# EAGLE design USB Client SP (EAGLE 5.04)
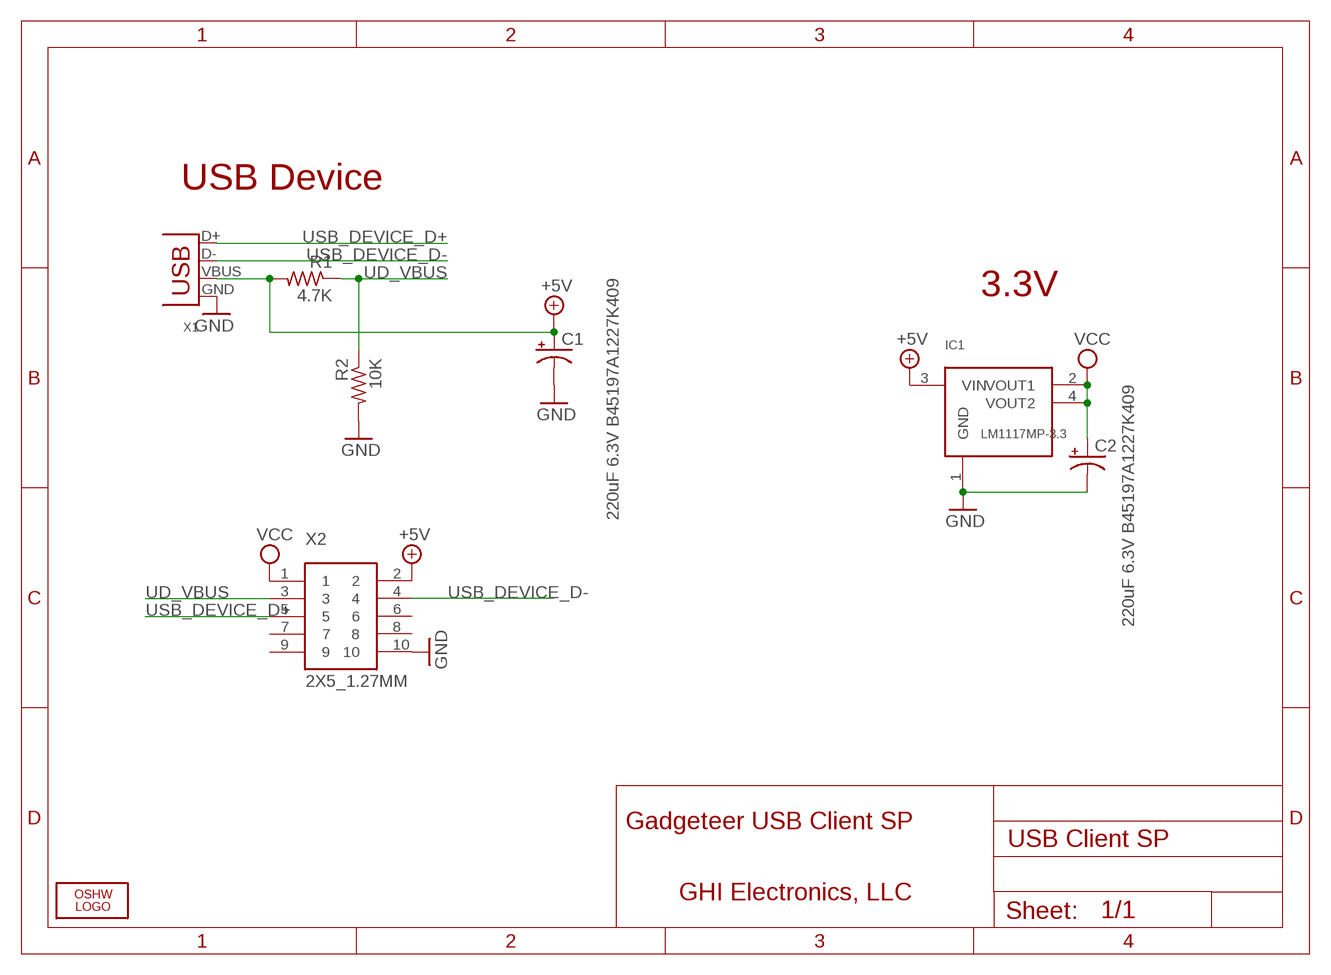
[diagram p0: schematic, sheet 1]

## Parts
C1  220uF 6.3V B45197A1227K409  CPOL-USD/7343-31W  [D/7343-31W]
C2  220uF 6.3V B45197A1227K409  CPOL-USD/7343-31W  [D/7343-31W]
IC1  LM1117MP-3.3  LM1117  [SOT223]
LOGO2  LOGO-OSHW-FILLX0200-NT  [OSHW_FILLX200_NOTEXT]
R1  4.7K  R-US_R0603  [R0603]
R2  10K  R-US_R0603  [R0603]
X1  DX2R005HN2E700  USB-MB-S  [USB-MB-S]
X2  2X5_1.27MM  [2X5_1.27MM]

## Nets
+5V [power]: C1.+ IC1.3(VIN) R1.2 X1.VBUS X2.2
GND [power]: C1.- C2.- IC1.1(GND) R2.2 X1.GND X2.10
UD_VBUS: R1.1 R2.1 X2.3
USB_DEVICE_D+: X1.D+ X2.5
USB_DEVICE_D-: X1.D- X2.4
VCC [power]: C2.+ IC1.2(VOUT1) IC1.4(VOUT2) X2.1
Unconnected: X2.6 X2.7 X2.8 X2.9

## Notes on the sheet
- USB Device
- 3.3V
- Gadgeteer USB Client SP
- GHI Electronics, LLC

## Library data of the parts
C1 C2 = rcl:CPOL-US: POLARIZED CAPACITOR, American symbol
IC1 = GHI:LM1117
LOGO2 = Logo:LOGO-OSHW-FILL
R1 R2 = rcl:R-US_: RESISTOR, American symbol
X1 = con-usb-3:USB: USB Connectors
X2 = GHI:2X5_1.27MM

## Net classes
0 default: width 0.254 mm, drill 0.381 mm, clearance 0.203 mm

## Board
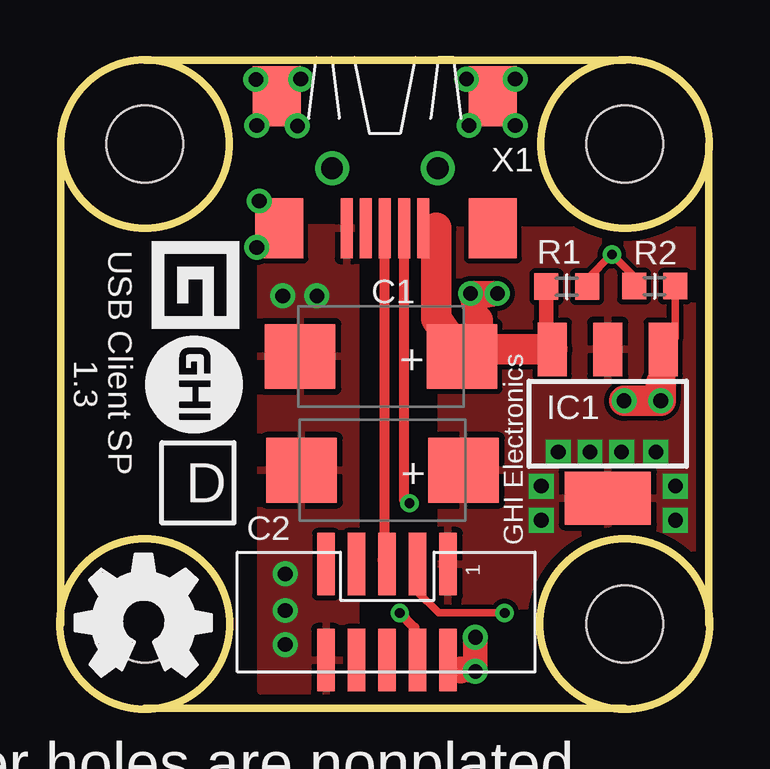
[diagram p1: board, top side]
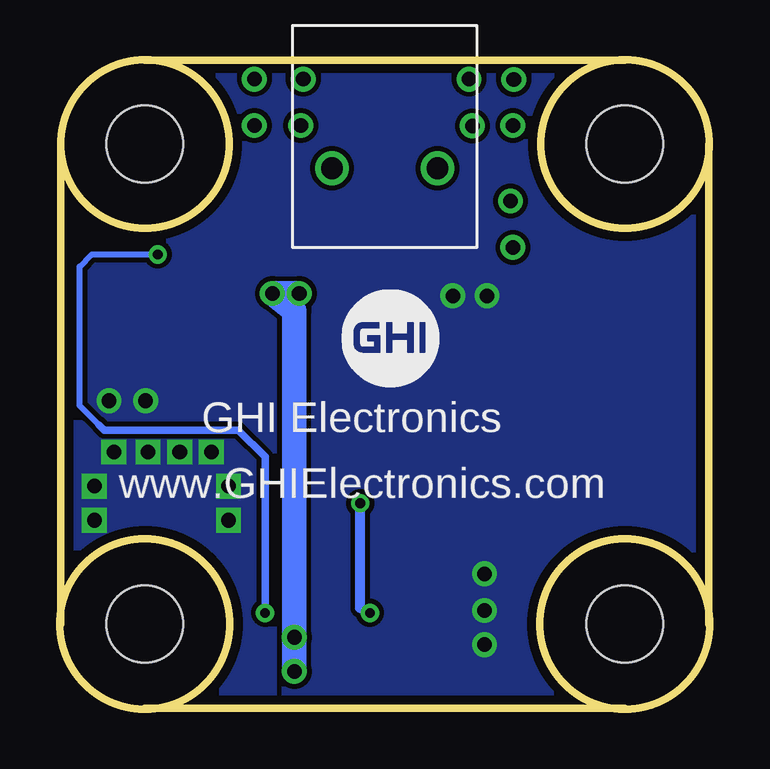
[diagram p2: board, bottom side, seen from below]

Size 27.07 x 27.04 mm. Coordinates in mm from the lower left corner, seen from the top.
Outline: 27.04,3.54 27.04,23.54
Outline: 0.04,23.54 0.04,3.54
Outline: 3.54,27.04 23.54,27.04
Outline: 23.54,0.04 3.54,0.04
Outline: circle at 3.54,23.54 radius 3.5
Outline: circle at 23.54,23.54 radius 3.5
Outline: circle at 23.54,3.54 radius 3.54
Outline: circle at 3.54,3.54 radius 3.54
Copper layers (1+16): Top 0.035mm / dielectric 1.5mm / Bottom 0.035mm
Design rules "default *": minimum track width 8mil, minimum drill 12mil, track to track 8mil, track to pad 8mil, pad to pad 8mil, via to via 8mil, smd to smd 8mil, copper to edge 15mil, drill to drill 8mil, minimum pad ring 10mil, minimum via ring 7mil, stop-mask expansion 4mil, vias tented up to drill 50mil, thermal gap 10mil
Holes 3.2 mm at 3.54,3.54 23.54,23.54 3.54,23.54 23.54,3.54

### Footprints (pad centres in the part's own frame; a part is rotated, then mirrored left to right if it is on the bottom)
D/7343-31W = smd 2.95 x 2.7: + 3.375,0; - -3.375,0
SOT223 = smd 1.219 x 2.235: 1 -2.311,-3.099; 2 0,-3.099; 3 2.311,-3.099 | smd 3.6 x 2.2: 4 0,3.099
R0603 = smd 1 x 1.1: 1 -0.85,0; 2 0.85,0
USB-MB-S = smd 2.5 x 0.5: D+ 2.5,0; D- 2.5,0.8; GND 2.5,-1.6; ID 2.5,-0.8; VBUS 2.5,1.6 | smd 2.5 x 2: P$1 -3,-4.5; P$2 -3,4.5; P$3 2.5,-4.4; P$4 2.5,4.5 | drill 0.9 round: P$5 0,2.2; P$6 0,-2.2
2X5_1.27MM = smd 2.6 x 0.74: 1 -2,2.58; 2 2,2.58; 3 -2,1.31; 4 2,1.31; 5 -2,0.04; 6 2,0.04; 7 -2,-1.23; 8 2,-1.23; 9 -2,-2.5; 10 2,-2.5

### Placement (x,y rotation side)
C1  13.38,14.69 0 top
C2  13.43,9.94 0 top
IC1  22.82,11.88 180 top
LOGO2  0.65,1.36 0 top
R1  21.12,17.59 180 top
R2  24.78,17.61 0 top
X1  13.54,22.52 270 top
X2  13.59,4.03 270 top

### Tracks (layer width: path | path; a pad name or v marks a point on that pad's centre or on a via)
+5V  (via drill 0.61)
  Top 0.305: X1.VBUS 15.45,19.61 15.68,20.05
  Top 0.406: C1.+ 16.77,14.77 | X2.2 16.23,2.03 16.7,1.56
  Top 0.61: R1.2 20.27,15.65 IC1.3
  Top 1.016: 16.7,1.56 16.7,1.66 v17.31,1.56 v17.31,2.98 | 17.21,17.1 17.41,16.19 v17.1,17.31 | v17.1,17.31 v18.22,17.31 17.21,17.1 | v17.1,17.31 17.21,17.1
  Top 1.27: 15.68,20.05 15.68,16.26 C1.+ 17.37,15.21 | 17.41,16.19 17.41,15.34 | 17.41,15.34 17.37,15.21 | 17.41,15.34 17.48,15.28 | IC1.3 17.65,14.98 17.37,15.21
  Bottom 1.016: v17.31,2.98 v17.31,1.56 17.31,16.6 v18.22,17.31 v17.1,17.31
GND  (via drill 0.61)
  Top 0.305: R2.2 25.63,15.47 IC1.1
  Top 1.016: 25.03,13.55 25.13,13.55 IC1.1
  Top 1.27: 25.03,13.55 v25.03,12.84 v23.51,12.84
  other vias: 9.28,17.21 10.7,17.21 9.38,2.68 9.38,4.1 9.38,5.62
  pour Bottom (rank 2): -0.17,27.16 27.06,27.16 27.06,-0.07 -0.17,-0.07
  pour Top: 12.33,20.05 8.37,20.05 8.37,0.75 12.33,0.75
N$1  (via drill 0.61)
  other vias: 9.89,24.29
N$2  (via drill 0.61)
  other vias: 8.16,26.22
N$11  (via drill 0.61)
  other vias: 18.97,26.24
N$12  (via drill 0.61)
  other vias: 18.97,24.31
N$14  (via drill 0.61)
  other vias: 16.94,26.24
N$15  (via drill 0.61)
  other vias: 17.04,24.31
N$17  (via drill 0.61)
  other vias: 8.2,24.31
N$18  (via drill 0.61)
  other vias: 8.3,21.16
N$19  (via drill 0.61)
  other vias: 8.2,19.23
N$16234  (via drill 0.61)
  other vias: 10.03,26.24
UD_VBUS  (via drill 0.41)
  Top 0.305: X2.3 14.9,4.89 15.78,4 v18.53,4 | R1.1 21.98,17.92 v23,18.93 23.93,18.01 R2.1
  Bottom 0.254: v23,18.93 25.74,18.93 26.25,18.43 26.25,12.63 25.44,11.82
  Bottom 0.305: v18.53,4 18.53,10.5 19.64,11.62 25.23,11.62 25.44,11.82
USB_DEVICE_D+
  Top 0.406: X1.D+ 13.54,7.05 13.65,6.44 13.45,6.21 X2.5
USB_DEVICE_D-  (via drill 0.41)
  Top 0.406: X1.D- 14.34,8.69 v14.56,8.57 | v14.16,4 14.77,3.39 14.77,2.16 X2.4
  Bottom 0.406: v14.56,8.57 14.56,4.2 v14.16,4
VCC  (via drill 0.61)
  other vias: 20.76,10.7 22.08,10.7 23.4,10.7 24.83,10.7 25.64,9.28 25.64,7.86 20.05,7.86 20.05,9.28
  pour Top: 26.55,19.95 26.55,4.3 15.89,4.3 15.89,19.95 26.45,19.95
  pour Bottom: 26.68,11.82 26.68,0.54 18.22,0.54 18.22,11.82

### Text on the board
tPlace: USB Client SP | 1.3 | D | GHI Electronics | corner holes are nonplated | red PCB with white text | do not add manufacturing codes
bPlace: GHI Electronics | www.GHIElectronics.com
201bmp: C:/Users/Gus Issa/Desktop/GHILogo_BW.bmp